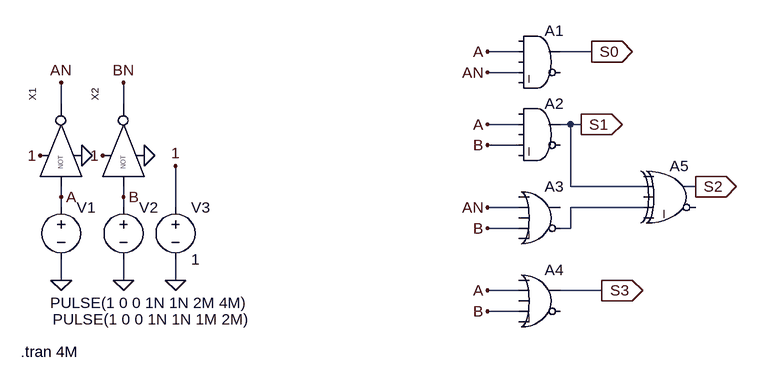
[diagram p0: schematic DECODER_LAB_1.asc]
DECODER_LAB_1.asc, the LTspice schematic file:
Version 4
SHEET 1 968 680
WIRE 608 -144 560 -144
WIRE 720 -144 672 -144
WIRE 608 -112 560 -112
WIRE -96 -64 -96 -96
WIRE 0 -64 0 -96
WIRE 608 -32 560 -32
WIRE 688 -32 672 -32
WIRE 704 -32 688 -32
WIRE 608 0 560 0
WIRE 688 64 688 -32
WIRE 800 64 688 64
WIRE 880 64 864 64
WIRE -96 80 -96 64
WIRE 0 80 0 64
WIRE -96 96 -96 80
WIRE 0 96 0 80
WIRE 80 96 80 32
WIRE 608 96 560 96
WIRE 800 96 688 96
WIRE 608 128 560 128
WIRE 688 128 688 96
WIRE 688 128 672 128
WIRE -96 208 -96 176
WIRE 0 208 0 176
WIRE 80 208 80 176
WIRE 608 224 560 224
WIRE 736 224 672 224
WIRE 608 256 560 256
FLAG 32 16 0
FLAG 80 208 0
FLAG 0 208 0
FLAG -96 208 0
FLAG -128 16 1
FLAG 80 32 1
FLAG -32 16 1
FLAG 0 80 B
FLAG -96 80 A
FLAG -96 -96 AN
FLAG 0 -96 BN
FLAG 560 -144 A
FLAG 560 -112 AN
FLAG 560 -32 A
FLAG 560 0 B
FLAG 560 96 AN
FLAG 560 128 B
FLAG 560 224 A
FLAG 560 256 B
FLAG 736 224 S3
IOPIN 736 224 Out
FLAG 880 64 S2
IOPIN 880 64 Out
FLAG 704 -32 S1
IOPIN 704 -32 Out
FLAG 720 -144 S0
IOPIN 720 -144 Out
FLAG -64 16 0
SYMBOL voltage -96 80 R0
WINDOW 3 -17 163 Left 2
WINDOW 123 0 0 Left 0
WINDOW 39 0 0 Left 0
SYMATTR InstName V1
SYMATTR Value PULSE(1 0 0 1N 1N 2M 4M)
SYMBOL voltage 0 80 R0
WINDOW 3 -109 188 Left 2
WINDOW 123 0 0 Left 0
WINDOW 39 0 0 Left 0
SYMATTR InstName V2
SYMATTR Value PULSE(1 0 0 1N 1N 1M 2M)
SYMBOL voltage 80 80 R0
WINDOW 123 0 0 Left 0
WINDOW 39 0 0 Left 0
SYMATTR InstName V3
SYMATTR Value 1
SYMBOL NOT4 -80 0 R270
SYMATTR InstName X1
SYMBOL NOT4 16 0 R270
SYMATTR InstName X2
SYMBOL Digital\\or 640 48 R0
SYMATTR InstName A3
SYMBOL Digital\\and 640 -192 R0
SYMATTR InstName A1
SYMBOL Digital\\and 640 -80 R0
SYMATTR InstName A2
SYMBOL Digital\\or 640 176 R0
SYMATTR InstName A4
SYMBOL Digital\\xor 848 16 R0
SYMATTR InstName A5
TEXT -158 318 Left 2 !.tran 4M

The netlist it stands for:
* DECODER_LAB_1.asc
V1 A 0 PULSE(1 0 0 1N 1N 2M 4M)
V2 B 0 PULSE(1 0 0 1N 1N 1M 2M)
V3 1 0 1
XX1 A 1 0 AN NOT4  ; pins A VH VL OUT
XX2 B 1 0 BN NOT4  ; pins A VH VL OUT
A3 0 AN 0 B 0 N001 0 0 OR
A1 0 A 0 AN 0 0 S0 0 AND
A2 0 A 0 B 0 0 S1 0 AND
A4 0 A 0 B 0 0 S3 0 OR
A5 0 S1 0 N001 0 0 S2 0 XOR
.tran 4M
.backanno
.end